# Altium project launchpad_breakout.PrjPcb
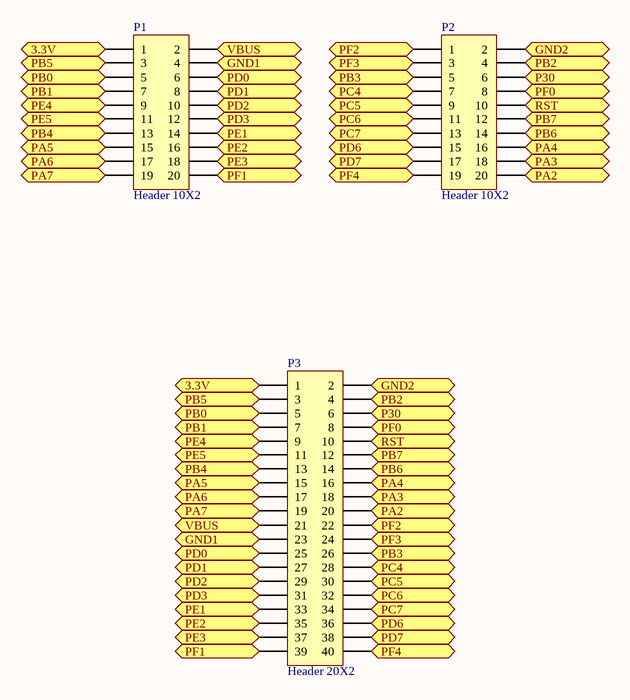
[diagram p0: lauchpad_breakout.SchDoc]
1 sheet, 3 parts. Net scope: flat (ports and power ports of the same name join across sheets).
Board file: launchpad_breakout.PcbDoc

## Sheet lauchpad_breakout.SchDoc
size A

### Parts
P1  Header 10X2  [HDR2X10]
P2  Header 10X2  [HDR2X10]
P3  Header 20X2  [2x20wide]

### Ports
3.3V, GND1, GND2, P30, PA2, PA3, PA4, PA5, PA6, PA7, PB0, PB1, PB2, PB3, PB4, PB5, PB6, PB7, PC4, PC5, PC6, PC7, PD0, PD1, PD2, PD3, PD6, PD7, PE1, PE2, PE3, PE4, PE5, PF0, PF1, PF2, PF3, PF4, RST, VBUS

### Nets
NetP1_1: P1.1 P3.1 ; port 3.3V
NetP1_2: P1.2 P3.21 ; port VBUS
NetP1_3: P1.3 P3.3 ; port PB5
NetP1_4: P1.4 P3.23 ; port GND1
NetP1_5: P1.5 P3.5 ; port PB0
NetP1_6: P1.6 P3.25 ; port PD0
NetP1_7: P1.7 P3.7 ; port PB1
NetP1_8: P1.8 P3.27 ; port PD1
NetP1_9: P1.9 P3.9 ; port PE4
NetP1_10: P1.10 P3.29 ; port PD2
NetP1_11: P1.11 P3.11 ; port PE5
NetP1_12: P1.12 P3.31 ; port PD3
NetP1_13: P1.13 P3.13 ; port PB4
NetP1_14: P1.14 P3.33 ; port PE1
NetP1_15: P1.15 P3.15 ; port PA5
NetP1_16: P1.16 P3.35 ; port PE2
NetP1_17: P1.17 P3.17 ; port PA6
NetP1_18: P1.18 P3.37 ; port PE3
NetP1_19: P1.19 P3.19 ; port PA7
NetP1_20: P1.20 P3.39 ; port PF1
NetP2_1: P2.1 P3.22 ; port PF2
NetP2_2: P2.2 P3.2 ; port GND2
NetP2_3: P2.3 P3.24 ; port PF3
NetP2_4: P2.4 P3.4 ; port PB2
NetP2_5: P2.5 P3.26 ; port PB3
NetP2_6: P2.6 P3.6 ; port P30
NetP2_7: P2.7 P3.28 ; port PC4
NetP2_8: P2.8 P3.8 ; port PF0
NetP2_9: P2.9 P3.30 ; port PC5
NetP2_10: P2.10 P3.10 ; port RST
NetP2_11: P2.11 P3.32 ; port PC6
NetP2_12: P2.12 P3.12 ; port PB7
NetP2_13: P2.13 P3.34 ; port PC7
NetP2_14: P2.14 P3.14 ; port PB6
NetP2_15: P2.15 P3.36 ; port PD6
NetP2_16: P2.16 P3.16 ; port PA4
NetP2_17: P2.17 P3.38 ; port PD7
NetP2_18: P2.18 P3.18 ; port PA3
NetP2_19: P2.19 P3.40 ; port PF4
NetP2_20: P2.20 P3.20 ; port PA2

### Library data of the parts
P1 P2 = Header 10X2: Header, 10-Pin, Dual row; LatestRevisionDate: 17-Jul-2002; LatestRevisionNote: Re-released for DXP Platform.; Publisher: Altium Limited
P3 = Header 20X2: Header, 20-Pin, Dual row; LatestRevisionDate: 17-Jul-2002; LatestRevisionNote: Re-released for DXP Platform.; Publisher: Altium Limited